# Altium schematic sheet ESP_Grow_Main_Rev_B_4_3V_5V.SchDoc: Power Rails
size A; Date: 5/4/2019; Author: Kyle R; Revision: B; SheetNumber: 2; SheetTotal: 3
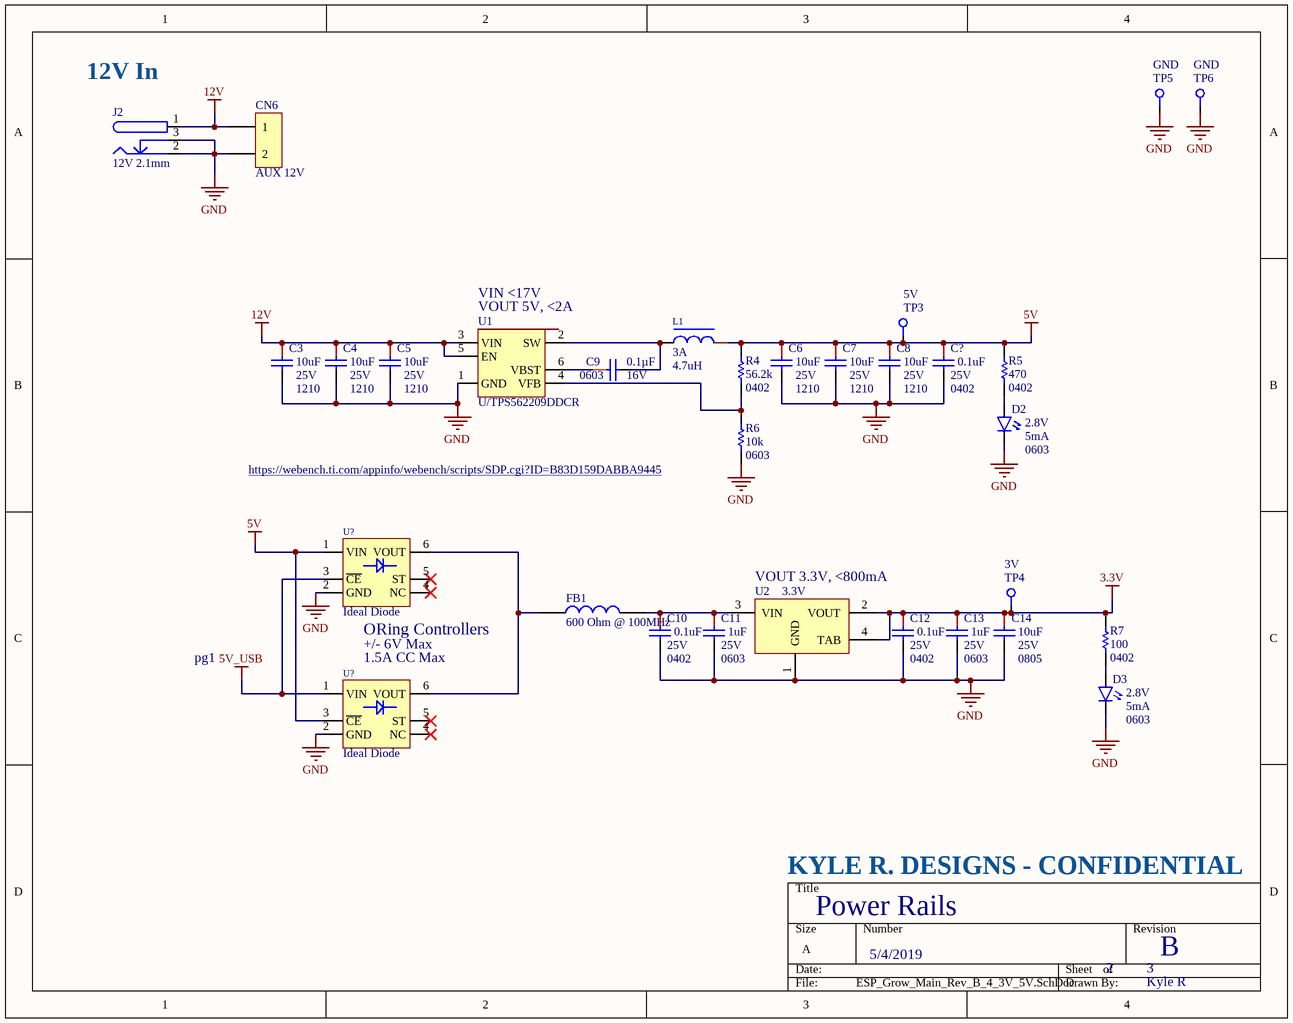
[diagram p0: ESP_Grow_Main_Rev_B_4_3V_5V.SchDoc]

## Parts
(Parts that share a designator on the sheet are numbered #1, #2 ... from top to bottom, then left to right.)
C3  10uF  Package / Case: 1210  Voltage Rated: 25V  [CAPC1210(3225)_N]
C4  10uF  Package / Case: 1210  Voltage Rated: 25V  [CAPC1210(3225)_N]
C5  10uF  Package / Case: 1210  Voltage Rated: 25V  [CAPC1210(3225)_N]
C6  10uF  Package / Case: 1210  Voltage Rated: 25V  [CAPC1210(3225)_N]
C7  10uF  Package / Case: 1210  Voltage Rated: 25V  [CAPC1210(3225)_N]
C8  10uF  Package / Case: 1210  Voltage Rated: 25V  [CAPC1210(3225)_N]
C9  Capacitance: 0.1µF  Package / Case: 0603  Voltage - Rated: 16V  [CAPC0603(1608)_L]  (hidden comment: 0.1uF)
C10  0.1uF  Package / Case: 0402  Voltage - Rated: 25V  [CAPC0402(1005)_N]
C11  1uF  Voltage - Rated: 25V  Package / Case: 0603  [CAPC0603(1608)_N]
C12  0.1uF  Package / Case: 0402  Voltage - Rated: 25V  [CAPC0402(1005)_N]
C13  1uF  Voltage - Rated: 25V  Package / Case: 0603  [CAPC0603(1608)_N]
C14  10uF  Voltage - Rated: 25V  Package / Case: 0805  [CAPC0805(2012)_L]
C?  0.1uF  Package / Case: 0402  Voltage - Rated: 25V  [CAPC0402(1005)_N]
CN6  AUX 12V  [Molex 1x2 Microfit 3.0]
D2  Package / Case: 0603  Current - Test: 5mA  Voltage - Forward (Vf) (Typ): 2.8V  [D/0603]  (hidden comment: D/LEDB/0603)
D3  Package / Case: 0603  Current - Test: 5mA  Voltage - Forward (Vf) (Typ): 2.8V  [D/0603]  (hidden comment: D/LEDB/0603)
FB1  600 Ohm @ 100MHz  [RESC0805(2012)_N]
J2  12V 2.1mm  [CONN_PWR_JACK_2.1x5.5mm]
L1  Current Rating (Amps): 3A  [INDP6060X45N]  (hidden comment: 4.7uH)
R4  Resistance (Ohms): 56.2k  Package / Case: 0402  [RESC0402(1005)_N]  (hidden comment: 56.2K 1%)
R5  Package / Case: 0402  [RESC0402(1005)_N]  (hidden comment: 470)
R6  Resistance (Ohms): 10k  Package / Case: 0603  [RESC0603(1608)_N]  (hidden comment: 10K 1%)
R7  100  Supplier Device Package: 0402  [RESC0402(1005)_N]
TP3  5V  [Pogo-Testpoint]  (no BOM)
TP4  3V  [Pogo-Testpoint]  (no BOM)
TP5  GND  [Pogo-Testpoint]  (no BOM)
TP6  GND  [Pogo-Testpoint]  (no BOM)
U1  U/TPS562209DDCR  [SOT-23]
U2  3.3V  [DSO-G3]
U?#1  Ideal Diode  [SC-70-6]
U?#2  Ideal Diode  [SC-70-6]

## Nets
3.3V: C12.1 C13.1 C14.1 R7.2 TP4.1 U2.2(VOUT) U2.4(TAB)
5V: C6.1 C7.1 C8.1 C?.1 L1.1 R4.2 R5.2 TP3.1 U?#1.1(VIN) U?#2.3(~{CE})
5V_USB: U?#1.3(~{CE}) U?#2.1(VIN)
12V: C3.1 C4.1 C5.1 CN6.1 J2.1 U1.3(VIN) U1.5(EN)
GND: C3.2 C4.2 C5.2 C6.2 C7.2 C8.2 C10.2 C11.2 C12.2 C13.2 C14.2 C?.2 CN6.2 D2.1 D3.1 J2.2 J2.3 R6.1 TP5.1 TP6.1 U1.1(GND) U2.1(GND) U?#1.2(GND) U?#2.2(GND)
NetC9_1: C9.1 U1.6(VBST)
NetC9_2: C9.2 L1.2 U1.2(SW)
NetC10_1: C10.1 C11.1 FB1.2 U2.3(VIN)
NetD2_2: D2.2 R5.1
NetD3_2: D3.2 R7.1
NetFB1_1: FB1.1 U?#1.6(VOUT) U?#2.6(VOUT)
NetR4_1: R4.1 R6.2 U1.4(VFB)

Not connected (* = marked no-connect by the designer): U?#1 4(NC)* 5(ST)*; U?#2 4(NC)* 5(ST)*

## Notes on the sheet
- (near J2) 12V In
- (near U1) VIN <17V
- (near U1) VOUT 5V, <2A
- (near R6) https://webench.ti.com/appinfo/webench/scripts/SDP.cgi?ID=B83D159DABBA9445
- (near U?#1) ORing Controllers
- (near U2) VOUT 3.3V, <800mA
- pg1
- (near U?#2) 1.5A CC Max
- (near U?#2) +/- 6V Max
- KYLE R. DESIGNS - CONFIDENTIAL

## Library data of the parts
C3-C8 = CAP CER 10UF 25V JB 1210: 10uF 1210 25V; Manufacturer: TDK Corporation; Manufacturer Part Number: C3225JB1E106K250AA; Tolerance: ±10%; Temperature Coefficient: JB; Notification: Current market demand for these product types have resulted in fluctuating and extending lead times. Lead times may differ.; Supplier 1: Digi-Key; RoHS: RoHS Compliant; Category: Capacitors; Stock 1: 19014; Pricing 1: 1=0.74, 10=0.525, 100=0.3454, 500=0.25588 (USD); Packaging: Cut Tape (CT); Part Status: Active; Operating Temperature: -25°C ~ 85°C; Ratings: -; Applications: General Purpose; Failure Rate: -; Mounting Type: Surface Mount, MLCC; Size / Dimension: 0.126" L x 0.098" W (3.20mm x 2.50mm); Height - Seated (Max): -; Thickness (Max): 0.110" (2.80mm); Lead Spacing: -; Lead Style: -; ComponentLink1URL: https://product.tdk.com/info/en/catalog/datasheets/mlcc_commercial_general_en.pdf; ComponentLink1Description: https://product.tdk.com/info/en/catalog/datasheets/mlcc_commercial_general_en.pdf; Supplier Part Number 1: 445-11850-1-ND; Voltage - Rated: 25V; Features: Low ESL
C9 = CAP CER 0.1UF 16V 10% X7R 0603: 0.1uF 0603 16V; Manufacturer: Kemet; Manufacturer Part Number: C0603C104K4RACTU; Tolerance: ±10%; Temperature Coefficient: X7R; Supplier 1: Digi-Key; RoHS: RoHS Compliant; Category: Capacitors; Stock 1: 2360000; Pricing 1: 4000=0.00414, 8000=0.00378, 12000=0.0036, 28000=0.00342, 100000=0.00248 (USD); Packaging: Tape & Reel (TR); Mounting Type: Surface Mount, MLCC; Operating Temperature: -55°C ~ 125°C; Applications: General Purpose; Ratings: -; Size / Dimension: 0.063" L x 0.031" W (1.60mm x 0.80mm); Height - Seated (Max): -; Thickness (Max): 0.034" (0.87mm); Lead Spacing: -; Features: -; Lead Style: -; ComponentLink1URL: http://www.kemet.com/datasheets&C0603C104K4RACTU; ComponentLink1Description: http://www.kemet.com/datasheets&C0603C104K4RACTU; Supplier Part Number 1: 399-1096-2-ND
C10 C12 C? = CAP CER 0.1UF 25V 10% X5R 0402: 0.1uF 0402 25V; Manufacturer: Taiyo Yuden; Manufacturer Part Number: TMK105BJ104KV-F; Tolerance: ±10%; Temperature Coefficient: X5R; Notification: Current market demand for these product types have resulted in fluctuating and extending lead times. Lead times may differ.; Supplier 1: Digi-Key; RoHS: RoHS Compliant; Category: Capacitors; Stock 1: 5172635; Pricing 1: 1=0.1, 10=0.043, 100=0.019, 500=0.0136, 1000=0.01069, 2500=0.00972, 5000=0.00894 (USD); Packaging: Cut Tape (CT); Part Status: Active; Operating Temperature: -55°C ~ 85°C; Features: -; Ratings: -; Applications: General Purpose; Mounting Type: Surface Mount, MLCC; Size / Dimension: 0.039" L x 0.020" W (1.00mm x 0.50mm); Height - Seated (Max): -; Thickness (Max): 0.022" (0.55mm); Lead Spacing: -; Lead Style: -; ComponentLink1URL: http://ds.yuden.co.jp/TYCOMPAS/ut/detail.do?productNo=TMK105BJ104KV-F&fileName=TMK105BJ104KV-F_SS&mode=specSheetDownload; ComponentLink1Description: http://ds.yuden.co.jp/TYCOMPAS/ut/detail.do?productNo=TMK105BJ104KV-F&fileName=TMK105BJ104KV-F_SS&mode=specSheetDownload; Supplier Part Number 1: 587-1456-1-ND
C11 C13 = CAP CER 1UF 25V 10% X7R 0603: 1uF 0603 25V; Manufacturer: TDK Corporation; Manufacturer Part Number: CGA3E1X7R1E105K080AC; Tolerance: ±10%; Temperature Coefficient: X7R; Supplier 1: Digi-Key; RoHS: RoHS Compliant; Category: Capacitors; Stock 1: 360610; Pricing 1: 1=0.2, 10=0.135, 100=0.0686, 500=0.04696, 1000=0.04154 (USD); Packaging: Cut Tape (CT); Part Status: Active; Operating Temperature: -55°C ~ 125°C; Features: -; Ratings: AEC-Q200; Applications: Automotive; Failure Rate: -; Mounting Type: Surface Mount, MLCC; Size / Dimension: 0.063" L x 0.032" W (1.60mm x 0.80mm); Height - Seated (Max): -; Thickness (Max): 0.035" (0.90mm); Lead Spacing: -; Lead Style: -; ComponentLink1URL: https://product.tdk.com/info/en/catalog/datasheets/mlcc_automotive_general_en.pdf; ComponentLink1Description: https://product.tdk.com/info/en/catalog/datasheets/mlcc_automotive_general_en.pdf; Supplier Part Number 1: 445-6931-1-ND
C14 = CAP CER 10UF 25V X6S 0805: 10UF 25V X6R 0805; Manufacturer: Murata Electronics North America; Manufacturer Part Number: GRM21BC81E106ME51L; Tolerance: ±20%; Temperature Coefficient: X6S; Notification: Current market demand for these product types have resulted in fluctuating and extending lead times. Lead times may differ.; Supplier 1: Digi-Key; RoHS: RoHS Compliant; Category: Capacitors; Stock 1: 23735; Pricing 1: 1=0.29, 10=0.199, 100=0.1009, 500=0.06906, 1000=0.0611 (USD); Packaging: Cut Tape (CT); Part Status: Active; Operating Temperature: -55°C ~ 105°C; Features: -; Ratings: -; Applications: General Purpose; Mounting Type: Surface Mount, MLCC; Size / Dimension: 0.079" L x 0.049" W (2.00mm x 1.25mm); Height - Seated (Max): -; Thickness (Max): 0.055" (1.40mm); Lead Spacing: -; Lead Style: -; ComponentLink1URL: http://search.murata.co.jp/Ceramy/image/img/A01X/G101/ENG/GRM21BC81E106ME51-01.pdf; ComponentLink1Description: http://search.murata.co.jp/Ceramy/image/img/A01X/G101/ENG/GRM21BC81E106ME51-01.pdf; Supplier Part Number 1: 490-10503-1-ND
CN6 = MICROFIT 3.0 HDR VERT CPI 2CKT: Molex Microfit 1x2 Vert Header; Manufacturer: Molex, LLC; Manufacturer Part Number: 0430450227; Shrouding: Shrouded - 4 Wall; Number of Positions: 2; Number of Positions Loaded: All; Row Spacing: 0.118" (3.00mm); Supplier 1: Digi-Key; RoHS: RoHS Compliant; Category: Connectors, Interconnects; Stock 1: 4002; Pricing 1: 1=0.8, 10=0.705, 50=0.636, 100=0.6083, 250=0.553, 500=0.4977, 1000=0.4424, 2500=0.40092, 5000=0.3871 (USD); Packaging: Tray; Part Status: Active; Connector Type: Header; Contact Type: Male Pin; Pitch: -; Number of Rows: 2; Mounting Type: Through Hole; Termination: Solder; Fastening Type: Locking Ramp; Contact Mating Length: -; Features: Board Guide; Contact Finish: Tin; Contact Finish Thickness: 60µin (1.52µm); Color: Black; ComponentLink1URL: http://www.molex.com/pdm_docs/sd/430450227_sd.pdf; ComponentLink1Description: http://www.molex.com/pdm_docs/sd/430450227_sd.pdf; Supplier Part Number 1: WM10657-ND
FB1 = FERRITE 600 OHM 2.0A 0805: 600 OHM 0805 2.0A; Manufacturer: Wurth Electronics Inc; Manufacturer Part Number: 742792040; Current Rating: 2A; DC Resistance (DCR): 150 mOhm Max; Filter Type: Differential Mode - Single; Supplier 1: Digi-Key; RoHS: RoHS Compliant; Category: Filters; Stock 1: 34670; Pricing 1: 1=0.24, 50=0.2344, 100=0.2156, 500=0.20624, 1000=0.19687, 2000=0.1875 (USD); Packaging: Cut Tape (CT); Package / Case: 0805 (2012 Metric); Mounting Type: Surface Mount; Height (Max): 0.043" (1.10mm); Size / Dimension: 0.079" L x 0.047" W (2.00mm x 1.20mm); ComponentLink1URL: http://katalog.we-online.de/pbs/datasheet/742792040.pdf; ComponentLink1Description: http://katalog.we-online.de/pbs/datasheet/742792040.pdf; Supplier Part Number 1: 732-1620-1-ND; ClassName: *; Creator: osman; Impedance @ Frequency: 600 Ohm @ 100MHz
J2 = CONN PWR JACK 2.1: 2.1 mm barrel jack; Manufacturer: CUI Inc; Manufacturer Part Number: PJ-002A; Gender: Male; Plug/Mating Plug Diameter: 2.1mm ID, 5.5mm OD; Number of Positions/Contacts: 2 Conductors, 3 Contacts; Internal Switch(s): Single Switch, Normally Closed; Shielding: Unshielded; Voltage - Rated: 16VDC; Current Rating: 2.5A; Published: 17-Dec-2003; DatasheetDocument: 09-May-2002; Publisher: Altium Limited; ComponentLink1Description: Manufacturer Link; ComponentLink1URL: http://domino.kycon.com/internet/Products.html; RoHS: RoHS Compliant; Category: Connectors, Interconnects; Connector Type: Jack; Mounting Type: Through Hole, Right Angle; Termination: Solder Eyelet(s); Features: -; Color: Black; Contact Material: Copper Alloy; Contact Material - Plating: Tin; Housing Color: Black; Housing Material: Thermoplastic; Operating Temperature: -25°C ~ 85°C; ComponentLink2URL: http://www.cui.com/product/resource/digikeypdf/pj-002a.pdf; ComponentLink2Description: http://www.cui.com/product/resource/digikeypdf/pj-002a.pdf; Supplier 1: Digi-Key; Stock 1: 47553; Pricing 1: 1=1.01, 10=0.704, 100=0.4724, 500=0.3819, 1000=0.3417, 2500=0.27135 (USD); ComponentLink3URL: http://www.cui.com/product/resource/digikeypdf/pj-002ah.pdf; ComponentLink3Description: http://www.cui.com/product/resource/digikeypdf/pj-002ah.pdf; Supplier Part Number 1: CP-002AH-ND
L1 = L/4.7uH/3A: FIXED IND 4.7UH 3A 37.6 MOHM SMD; Manufacturer Part Number: SRN6045-4R7Y; Current Saturation (Amps): 4A; Shielding: Semi-Shielded; DC Resistance (DCR): 37.6mOhm Max; Datasheet: https://www.bourns.com/data/global/pdfs/SRN6045.pdf; Size / Dimension: 0.236" L x 0.236" W (6.00mm x 6.00mm); Inductance: 4.7uH
R4 = RES 56.2K OHM 1% 1/10W 0402: 56.2K 1% 0402; Manufacturer: Panasonic Electronic Components; Manufacturer Part Number: ERJ-2RKF5622X; Power (Watts): 0.1W, 1/10W; Temperature Coefficient: ±100ppm/°C; Supplier 1: Digi-Key; RoHS: RoHS Compliant; Category: Resistors; Stock 1: 222789; Pricing 1: 1=0.1, 50=0.0124, 100=0.0091, 250=0.00692, 500=0.00554, 1000=0.00408, 5000=0.00293 (USD); Packaging: Cut Tape (CT); Part Status: Active; Tolerance: ±1%; Composition: Thick Film; Features: Automotive AEC-Q200; Operating Temperature: -55°C ~ 155°C; Supplier Device Package: 0402; Size / Dimension: 0.039" L x 0.020" W (1.00mm x 0.50mm); Height: 0.016" (0.40mm); Number of Terminations: 2; Failure Rate: -; ComponentLink1URL: http://industrial.panasonic.com/www-cgi/jvcr13pz.cgi?E+PZ+3+AOA0002+ERJ2RKF5622X+7+WW; ComponentLink1Description: http://industrial.panasonic.com/www-cgi/jvcr13pz.cgi?E+PZ+3+AOA0002+ERJ2RKF5622X+7+WW; Supplier Part Number 1: P56.2KLCT-ND
R5 = RES 470 OHM 1% 1/10W 0402: 470 0402; Manufacturer: Panasonic Electronic Components; Manufacturer Part Number: ERJ-2RKF4700X; Tolerance: ±1%; Power (Watts): 0.1W, 1/10W; Temperature Coefficient: ±100ppm/°C; Supplier 1: Digi-Key; RoHS: RoHS Compliant; Category: Resistors; Stock 1: 342632; Pricing 1: 1=0.1, 10=0.025, 25=0.018, 50=0.0136, 100=0.01, 250=0.00764, 500=0.00612, 1000=0.00451, 5000=0.00323 (USD); Packaging: Cut Tape (CT); Part Status: Active; Resistance (Ohms): 470; Composition: Thick Film; Features: Automotive AEC-Q200; Operating Temperature: -55°C ~ 155°C; Size / Dimension: 0.039" L x 0.020" W (1.00mm x 0.50mm); Height - Seated (Max): 0.016" (0.40mm); Number of Terminations: 2; Failure Rate: -; ComponentLink1URL: https://industrial.panasonic.com/cdbs/www-data/pdf/RDA0000/AOA0000C283.pdf; ComponentLink1Description: https://industrial.panasonic.com/cdbs/www-data/pdf/RDA0000/AOA0000C283.pdf; Supplier Part Number 1: P470LCT-ND; Supplier Device Package: 0402
R6 = RES 10K OHM 1/10W 1% 0603 SMD: 10K 0603; Manufacturer: Panasonic Electronic Components; Manufacturer Part Number: ERJ-3EKF1002V; Power (Watts): 0.1W, 1/10W; Temperature Coefficient: ±100ppm/°C; Category: Resistors; Supplier 1: Digi-Key; RoHS: RoHS Compliant; Stock 1: 5046430; Pricing 1: 1=0.1, 50=0.015, 100=0.0114, 250=0.00844, 500=0.00624, 1000=0.00416, 2500=0.00351 (USD); Packaging: Cut Tape (CT); Tolerance: ±1%; Composition: Thick Film; Features: -; Supplier Device Package: 0603; Size / Dimension: 0.063" L x 0.031" W (1.60mm x 0.80mm); Height: 0.022" (0.55mm); Number of Terminations: 2; ComponentLink1URL: http://industrial.panasonic.com/www-cgi/jvcr13pz.cgi?E+PZ+3+AOA0002+ERJ3EKF1002V+7+WW; ComponentLink1Description: http://industrial.panasonic.com/www-cgi/jvcr13pz.cgi?E+PZ+3+AOA0002+ERJ3EKF1002V+7+WW; Supplier Part Number 1: P10.0KHCT-ND
R7 = RES 100 OHM 1% 1/16W 0402: 100 0402; Manufacturer: Yageo; Manufacturer Part Number: RC0402FR-07100RL; Tolerance: ±1%; Power (Watts): 0.063W, 1/16W; Temperature Coefficient: ±100ppm/°C; Supplier 1: Digi-Key; RoHS: RoHS Compliant; Category: Resistors; Stock 1: 14557677; Pricing 1: 1=0.1, 10=0.014, 100=0.0056, 1000=0.00253, 2500=0.0022, 5000=0.00181 (USD); Packaging: Cut Tape (CT); Part Status: Active; Composition: Thick Film; Features: Moisture Resistant; Operating Temperature: -55°C ~ 155°C; Package / Case: 0402 (1005 Metric); Size / Dimension: 0.039" L x 0.020" W (1.00mm x 0.50mm); Height - Seated (Max): 0.016" (0.40mm); Failure Rate: -; ComponentLink1URL: http://www.yageo.com/documents/recent/PYu-RC_Group_51_RoHS_L_8.pdf; ComponentLink1Description: http://www.yageo.com/documents/recent/PYu-RC_Group_51_RoHS_L_8.pdf; Supplier Part Number 1: 311-100LRCT-ND
TP3-TP6 = CMP-001-0557-03: Test Point- Current one; Pin Count: 1; Component Name: TestPoint; Designator: TestPoint
U1 = U/TPS562209DDCR: IC REG BUCK ADJ 2A TSOT23-6; Voltage - Input (Min): 4.5V; Voltage - Input (Max): 17V; Voltage - Output (Min/Fixed): 0.765V; Voltage - Output (Max): 7V; Frequency - Switching: 650KHZ; Manufacturer Part Number: TPS562209DDCR; Topology: Buck; Current - Output: 2A; Supplier Device Package: TSOT-23-6
U2 = LD1117S33: 3.3 volt fixed regulator, 800mA; Supplier 1: Digi-Key; Supplier Part Number 1: 497-1242-1-ND
U?#1 U?#2 = LM66100DCKT: OR Controller P-Channel 1.5A CC
D2 D3 = D/LEDB/0603: Datasheet: https://everlightamericas.com/index.php?controller=attachment&id_attachment=3217; Supplier 1: Digi-Key; Supplier Part Number 1: 1080-1562-6-ND